# Altium schematic sheet DCDC_AP62600_5V.SchDoc: Input Switching 5V
size A4; DrawnBy: Marini; DocumentNumber: 2HSGB; Revision: 1.1; SheetNumber: 3; SheetTotal: 13
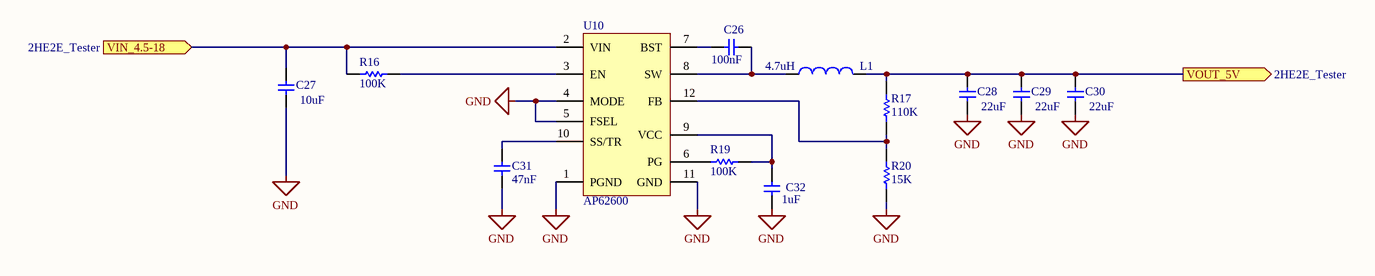
[diagram p0: DCDC_AP62600_5V.SchDoc]

## Parts
C26  value 100nF  [0603M-C]  (hidden comment: Cap Ceramic)
C27  value 10uF  [0603M]  (hidden comment: Cap Ceramic)
C28  value 22uF  [0603M]  (hidden comment: Cap Ceramic)
C29  value 22uF  [0603M]  (hidden comment: Cap Ceramic)
C30  value 22uF  [0603M]  (hidden comment: Cap Ceramic)
C31  value 47nF  [0603M]  (hidden comment: Cap Ceramic)
C32  value 1uF  [0603M-C]  (hidden comment: Cap Ceramic)
L1  value 4.7uH  [WE-LQSH_4020]  (hidden comment: Induttanza)
R16  value 100K  [0603M]  (hidden comment: Resistor)
R17  value 110K  [0603M]  (hidden comment: Resistor)
R19  value 100K  [0603M]  (hidden comment: Resistor)
R20  value 15K  [0603M]  (hidden comment: Resistor)
U10  AP62600  [VQFN2030-12(Type A)]

## Ports
VIN_4.5-18 (in, see 2HE2E_Tester), VOUT_5V (out, see 2HE2E_Tester)

## Nets
GND: C27.1 C28.1 C29.1 C30.1 C31.1 C32.1 R20.1 U10.1(PGND) U10.4(MODE) U10.5(FSEL) U10.11(GND)
VIN_4.5-18: C27.2 R16.1 U10.2(VIN) ; port VIN_4.5-18
VOUT_5V: C28.2 C29.2 C30.2 L1.2 R17.2 ; port VOUT_5V
NetC26_1: C26.1 U10.7(BST)
NetC26_2: C26.2 L1.1 U10.8(SW)
NetC31_2: C31.2 U10.10(SS/TR)
NetC32_2: C32.2 R19.2 U10.9(VCC)
NetR16_2: R16.2 U10.3(EN)
NetR17_1: R17.1 R20.2 U10.12(FB)
NetR19_1: R19.1 U10.6(PG)

## Library data of the parts
C26 = Cap Ceramic: Ceramic Capacitor
C27 C32 = Cap Ceramic: Ceramic Capacitor 16V
C28-C30 = Cap Ceramic: Ceramic Capacitor 10V
C31 = Cap Ceramic: Ceramic Capacitor 50V
L1 = Induttanza: 74405042047 WE-LQSH SMT High Saturation Power Inductor
U10 = AP62600: 4.5V TO 18VINPUT, 6A SYNCHRONOUS BUCK CONVERTER